# EAGLE schematic SwitchingBoard (EAGLE 7.7.0)
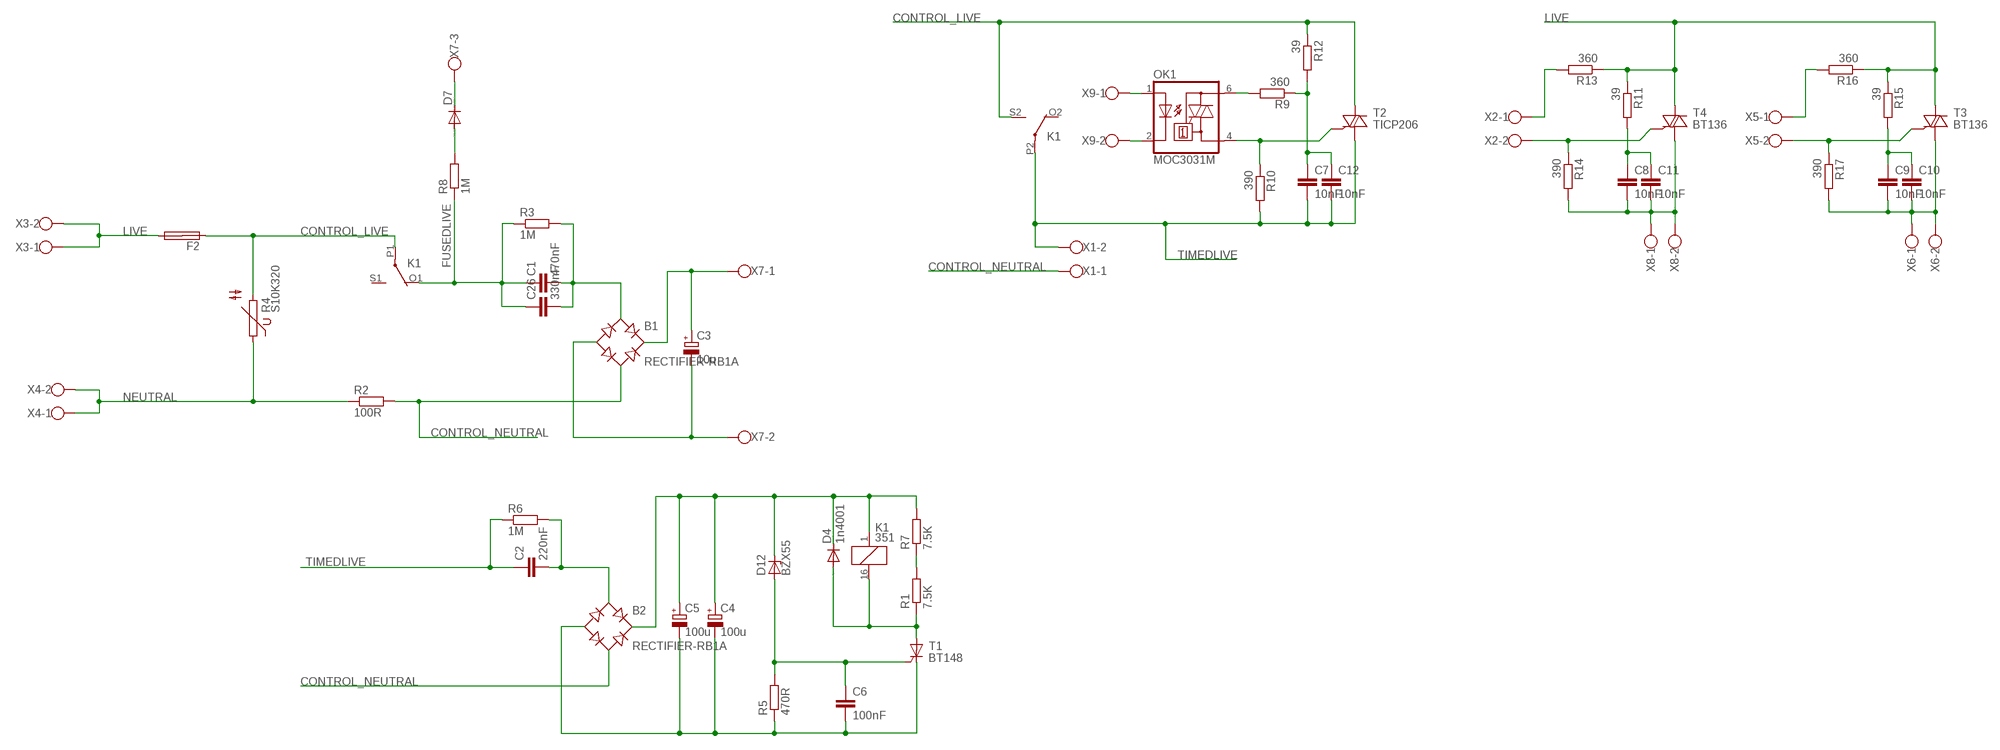
[diagram p0: schematic, sheet 1]

## Parts
B1  RECTIFIER-RB1A  [RB1A]
B2  RECTIFIER-RB1A  [RB1A]
C1  470nF  C-EU225-108X268  [C225-108X268]
C2  220nF  C-EU225-062X268  [C225-062X268]
C3  10u  CPOL-EUE2-5  [E2-5]
C4  100u  CPOL-EUE2.5-7  [E2,5-7]
C5  100u  CPOL-EUE2.5-7  [E2,5-7]
C6  100nF  C-EU050-024X044  [C050-024X044]
C7  10nF  C-EU150-054X183  [C150-054X183]
C8  10nF  C-EU150-054X183  [C150-054X183]
C9  10nF  C-EU150-054X183  [C150-054X183]
C10  10nF  C-EU102-043X133  [C102-043X133]
C11  10nF  C-EU102-043X133  [C102-043X133]
C12  10nF  C-EU102-043X133  [C102-043X133]
C26  330nF  C-EU150-091X182  [C150-091X182]
D4  1n4001  DIODE-DO41-10  [DO41-10]
D7  DIODE-DO41-10  [DO41-10]
D12  BZX55  [DO35Z10]
F2  SHKOG  [SHKOG]
K1  351  [351]
OK1  MOC3031M  [DIL06]
R1  7.5K  R-EU_0207/7  [0207/7]
R2  100R  R-EU_0617/22  [0617/22]
R3  1M  R-EU_0617/22  [0617/22]
R4  S10K320  [S10K320]
R5  470R  R-EU_0207/7  [0207/7]
R6  1M  R-EU_0617/22  [0617/22]
R7  7.5K  R-EU_0207/7  [0207/7]
R8  1M  R-EU_0617/22  [0617/22]
R9  360  R-EU_0207/7  [0207/7]
R10  390  R-EU_0207/7  [0207/7]
R11  39  R-EU_0207/7  [0207/7]
R12  39  R-EU_0207/7  [0207/7]
R13  360  R-EU_0207/7  [0207/7]
R14  390  R-EU_0207/7  [0207/7]
R15  39  R-EU_0207/7  [0207/7]
R16  360  R-EU_0207/7  [0207/7]
R17  390  R-EU_0207/7  [0207/7]
T1  BT148  [SOT82S]
T2  TICP206  [TO92-6]
T3  BT136  [TO220AB]
T4  BT136  [TO220AB]
X1  W237-102  [W237-102]
X2  W237-102  [W237-102]
X3  W237-102  [W237-102]
X4  W237-102  [W237-102]
X5  W237-102  [W237-102]
X6  W237-102  [W237-102]
X7  W237-103  [W237-103]
X8  W237-102  [W237-102]
X9  W237-102  [W237-102]

## Nets
CONTROL_LIVE: F2.1A K1.P1(2:P) K1.S2(3:S) R4.2 R12.1 T2.A2
CONTROL_NEUTRAL: B1.AC2 B2.AC2 R2.2 X1.1
FUSEDLIVE: C1.1 C26.1 K1.O1(2:O) R3.1 R8.1
LIVE: F2.2A R11.1 R13.1 R15.1 R16.1 T3.2(A2) T4.2(A2) X3.1 X3.2
N$1: D7.A R8.2
N$2: B2.AC1 C2.2 R6.2
N$3: R1.2 R7.1
N$4: B1.AC1 C1.2 C26.2 R3.2
N$5: D7.C X7.3
N$6: D4.A K1.16 R1.1 T1.A
N$7: C6.1 D12.A R5.2 T1.G
N$8: C8.2 C11.2 R14.2 T4.1(A1) X8.1 X8.2
N$9: OK1.6(A2) R9.2
N$10: OK1.1(A) X9.1
N$11: C9.2 C10.2 R17.2 T3.1(A1) X6.1 X6.2
N$12: OK1.2(C) X9.2
N$13: OK1.4(A1) R10.1 T2.G
N$14: C7.1 C12.1 R9.1 R12.2
N$15: R13.2 X2.1
N$16: C8.1 C11.1 R11.2
N$17: R14.1 T4.3(G) X2.2
N$20: C9.1 C10.1 R15.2
N$21: R16.2 X5.1
N$22: R17.1 T3.3(G) X5.2
NEUTRAL: R2.1 R4.1 X4.1 X4.2
RECT: B1.+ C3.+ X7.1
RECTRELAY: B2.+ C4.+ C5.+ D4.C D12.C K1.1 R7.2
TIMEDLIVE: C2.1 C7.2 C12.2 K1.P2(3:P) R6.1 R10.2 T2.A1 X1.2
ZERO: B1.- C3.- X7.2
ZERO1: B2.- C4.- C5.- C6.2 R5.1 T1.C
Unconnected: F2.1B F2.2B K1.O2(3:O) K1.S1(2:S)

## Library data of the parts
B1 B2 = rectifier:RECTIFIER-: Rectifier
C1 C2 C6-C12 C26 = rcl:C-EU: CAPACITOR, European symbol
C3-C5 = rcl:CPOL-EU: POLARIZED CAPACITOR, European symbol
D4 D7 = diode:DIODE-: DIODE
D12 = diode:BZX55: Z DIODE
F2 = fuse:SHKOG: FUSE HOLDER 5 x 20/6 x 32 mm, SH contact, OG 46G6083 Buerklin; OC_FARNELL: unknown; OC_NEWARK: unknown
K1 = relay:351: RELAY 2 x switch, Omron; OC_FARNELL: unknown; OC_NEWARK: unknown
OK1 = optocoupler:MOC30*: 6-Pin DIP Zero-Cross Optoisolators Triac Driver Output (250/400 Volt Peak) Source: Data sheet <http://www.fairchildsemi.com/ds/MO/MOC3031M.pdf> The old path of data sheet not more available 2013-05-06.; MF: FAIRCHILD SEMICONDUCTOR; MPN: MOC3031M; OC_FARNELL: 9875964; OC_NEWARK: 78K6089
R1-R3 R5-R17 = rcl:R-EU_: RESISTOR, European symbol
R4 = varistor:S10K320: VARISTOR
T1 = triac:BT148: THYRISTOR
T2 = triac:TICP206: TRIAC
T3 T4 = triac:BT136: Triac BT136 series E sensitive gate Source: http://www.nxp.com/acrobat_download/datasheets/BT136_SERIES_E_2.pdf
X1-X6 X8 X9 = con-wago-500:W237-102: WAGO SCREW CLAMP; MPN: 237-102; OC_FARNELL: unknown; OC_NEWARK: 70K9898
X7 = con-wago-500:W237-103: WAGO SCREW CLAMP; MPN: 237-103; OC_FARNELL: unknown; OC_NEWARK: 18M7116